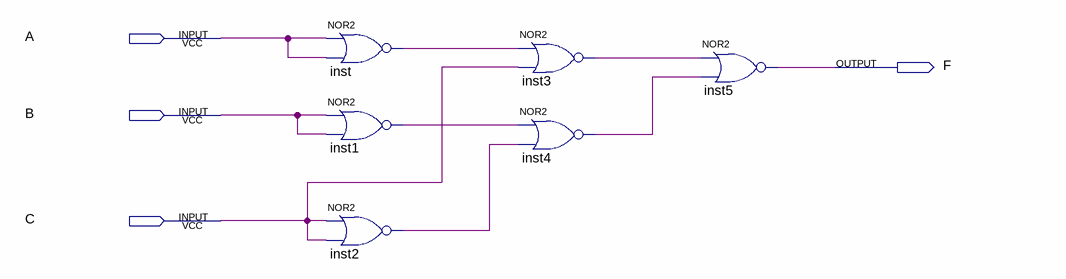
[diagram p0: schematic sheet]
// Quartus schematic nda1_2.bdf as structural Verilog: 6 symbols, 4 pins
module nda1_2 (
  input  A,
  input  B,
  input  C,
  output F
);

  wire inst1_out, inst2_out, inst3_out, inst4_out, inst_out;

  nor inst (inst_out, A, A);
  nor inst1 (inst1_out, B, B);
  nor inst2 (inst2_out, C, C);
  nor inst3 (inst3_out, inst_out, C);
  nor inst4 (inst4_out, inst1_out, inst2_out);
  nor inst5 (F, inst3_out, inst4_out);
endmodule
